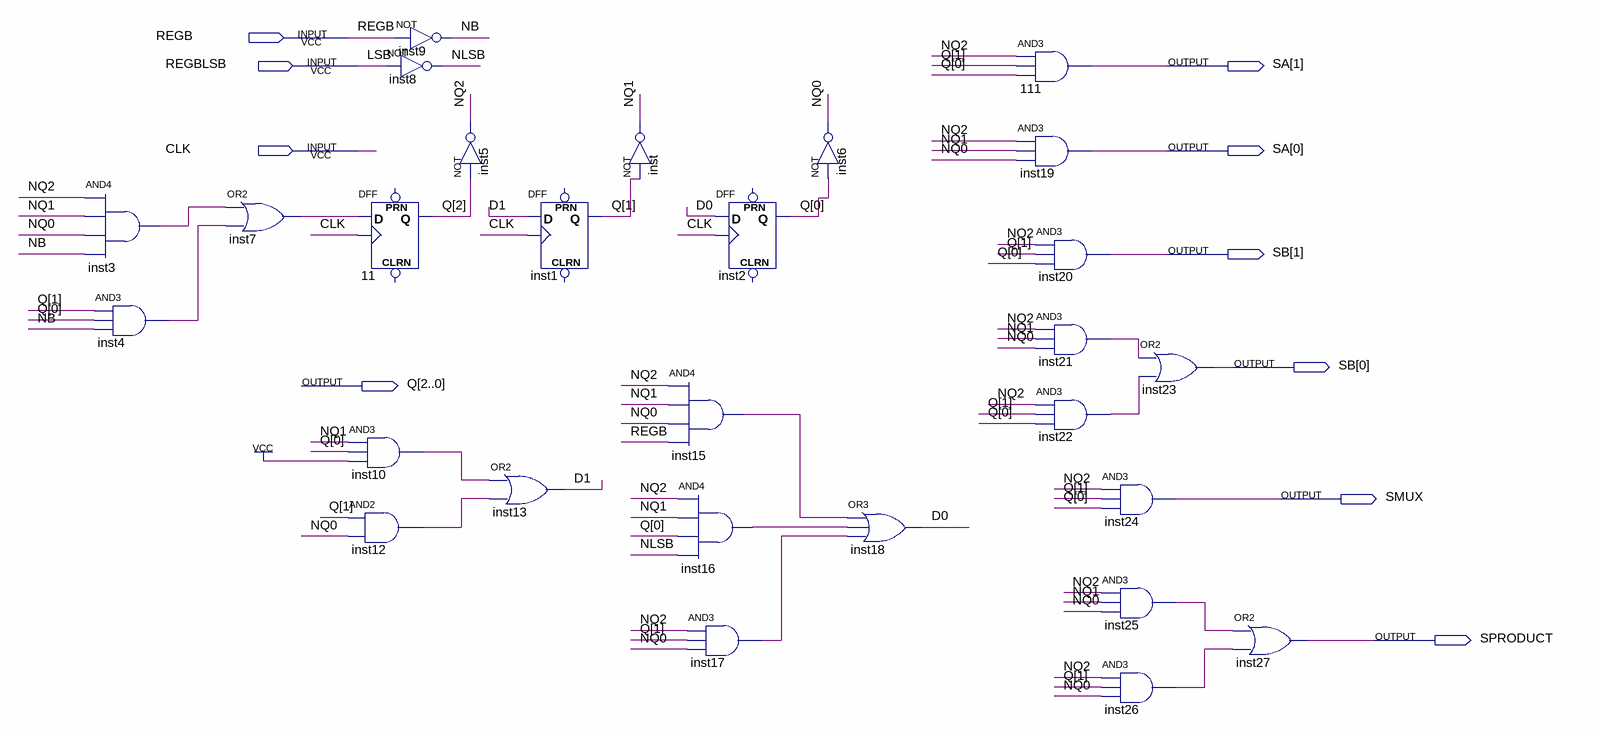
[diagram p0: schematic sheet]
// Quartus schematic controller.bdf as structural Verilog: 28 symbols, 10 pins
module controller (
  input  REGB,
  input  REGBLSB,
  input  CLK,
  output [1:0] SA,
  output [1:0] SB,
  output [2:0] Q,
  output SMUX,
  output SPRODUCT
);

  wire D0, D1, inst3_out, inst4_out, inst7_out, inst10_out, inst12_out, inst15_out, inst16_out, inst17_out,
       inst21_out, inst22_out, inst25_out, inst26_out, NB, NLSB, NQ0, NQ1, NQ2;

  and inst3 (inst3_out, NQ2, NQ1, NQ0, NB);
  and inst4 (inst4_out, Q[1], Q[0], NB);
  or inst7 (inst7_out, inst3_out, inst4_out);
  not inst8 (NLSB, REGBLSB);
  DFF u_11 (.CLK(CLK), .D(inst7_out), .Q(Q[2]));  // open: CLRN, PRN
  and inst10 (inst10_out, NQ1, Q[0], 1'b1);
  and inst12 (inst12_out, Q[1], NQ0);
  not inst9 (NB, REGB);
  not inst5 (NQ2, Q[2]);
  DFF inst1 (.CLK(CLK), .D(D1), .Q(Q[1]));  // open: CLRN, PRN
  or inst13 (D1, inst10_out, inst12_out);
  not inst (NQ1, Q[1]);
  and inst15 (inst15_out, NQ2, NQ1, NQ0, REGB);
  and inst16 (inst16_out, NQ2, NQ1, Q[0], NLSB);
  and inst17 (inst17_out, NQ2, Q[1], NQ0);
  DFF inst2 (.CLK(CLK), .D(D0), .Q(Q[0]));  // open: CLRN, PRN
  not inst6 (NQ0, Q[0]);
  or inst18 (D0, inst15_out, inst16_out, inst17_out);
  and u_111 (SA[1], NQ2, Q[1], Q[0]);
  and inst19 (SA[0], NQ2, NQ1, NQ0);
  and inst20 (SB[1], NQ2, Q[1], Q[0]);
  and inst21 (inst21_out, NQ2, NQ1, NQ0);
  and inst22 (inst22_out, NQ2, Q[1], Q[0]);
  or inst23 (SB[0], inst21_out, inst22_out);
  and inst24 (SMUX, NQ2, Q[1], Q[0]);
  and inst25 (inst25_out, NQ2, NQ1, NQ0);
  and inst26 (inst26_out, NQ2, Q[1], NQ0);
  or inst27 (SPRODUCT, inst25_out, inst26_out);

  // Other names for the same wires on the sheet: LSB = REGBLSB
endmodule
